# Altium schematic sheet CANdruino.SchDoc
size A3; SheetNumber: 1; SheetTotal: 1
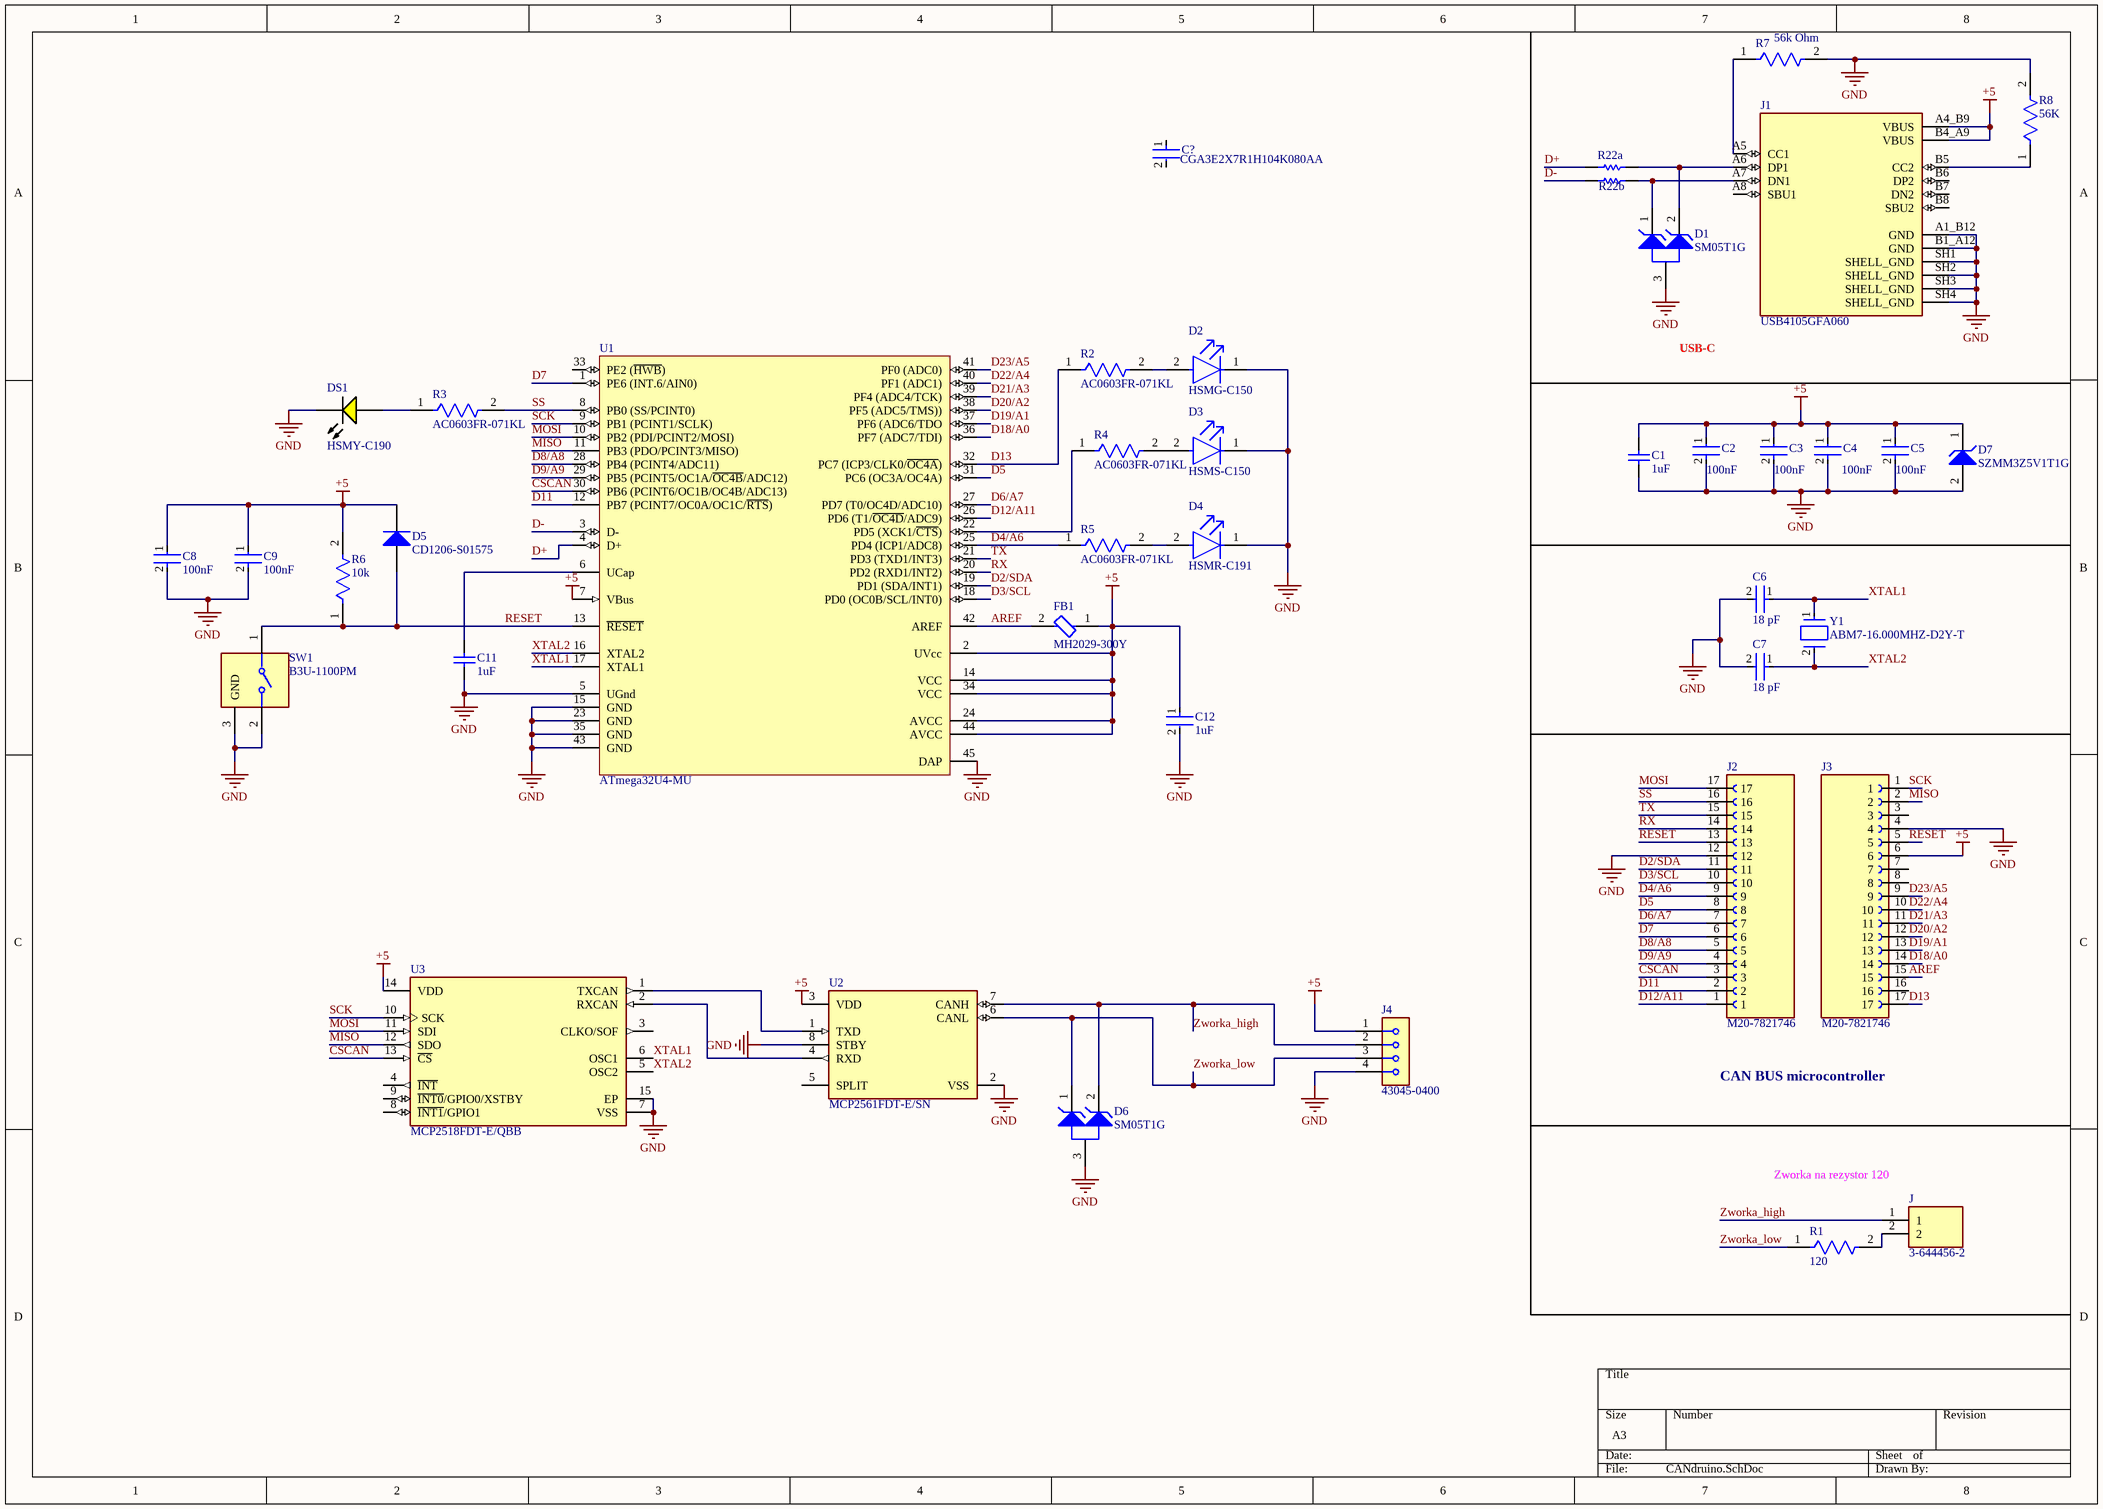
[diagram p0: CANdruino.SchDoc]

## Parts
C1  1uF  [CAPC2013X135X45LL10T25]
C2  100nF  [FP-GRM15-MFG]
C3  100nF  [FP-GRM15-MFG]
C4  100nF  [FP-GRM15-MFG]
C5  100nF  [FP-GRM15-MFG]
C6  18 pF  [FP-C0805C-DN-MFG]
C7  18 pF  [FP-C0805C-DN-MFG]
C8  100nF  [FP-GRM15-MFG]
C9  100nF  [FP-GRM15-MFG]
C11  1uF  [CAPC2013X135X45LL10T25]
C12  1uF  [FP-GRM15-0_1-MFG]
C?  CGA3E2X7R1H104K080AA  [FP-CGA3E-0_3-0_1-IPC_A]
D1  SM05T1G  [ONSC-SOT-23-3-318-08_V]
D2  HSMG-C150  [FP-HSMG-C150-MFG]
D3  HSMS-C150  [FP-HSMS-C150-MFG]
D4  HSMR-C191  [FP-HSMR-C191-MFG]
D5  CD1206-S01575  [BOUR-CD1206-S01575-2_L]
D6  SM05T1G  [ONSC-SOT-23-3-318-08_V]
D7  SZMM3Z5V1T1G  [ONSC-SOD-323-2-477-02_V]
DS1  HSMY-C190  [AVAG-HSMX-C190_V]
FB1  MH2029-300Y  [FP-MH2029-MFG]
J  3-644456-2  [TE_3-644456-2]
J1  USB4105GFA060  [GCT_USB4105GFA060]
J2  M20-7821746  [HARWIN_M20-7821746]
J3  M20-7821746  [HARWIN_M20-7821746]
J4  43045-0400  [MOLEX_43045-0400]
R1  120  [FP-CRCW0603-e3-MFG]
R2  AC0603FR-071KL  [FP-AC0603-IPC_B]
R3  AC0603FR-071KL  [FP-AC0603-IPC_B]
R4  AC0603FR-071KL  [FP-AC0603-IPC_B]
R5  AC0603FR-071KL  [FP-AC0603-IPC_B]
R6  10k  [FP-MCT0603-IPC_C]
R7  56k Ohm  [FP-RR0816-IPC_C]
R8  56K  [FP-RR0816-IPC_C]
R22a  22  [RESC1005X40X25LL05T05]  (value not drawn)
R22b  22  [RESC1005X40X25LL05T05]  (value not drawn)
SW1  B3U-1100PM  [FP-B3U-1100PM-MFG]
U1  ATmega32U4-MU  [44PW_M]
U2  MCP2561FDT-E/SN  [FP-C04-057-SN-MFG]
U3  MCP2518FDT-E/QBB  [FP-C04-21361-MFG]
Y1  ABM7-16.000MHZ-D2Y-T  [FP-ABM7-MFG]

## Nets
+5: C1.2 C2.1 C3.1 C4.1 C5.1 C8.1 C9.1 C12.1 D5.2(K) D7.1(K) FB1.1 J1.A4_B9(VBUS) J1.B4_A9(VBUS) J3.6 J4.1 R6.2 U1.2(UVcc) U1.7(VBus) U1.14(VCC) U1.24(AVCC) U1.34(VCC) U1.44(AVCC) U2.3(VDD) U3.14(VDD)
GND: C1.1 C2.2 C3.2 C4.2 C5.2 C6.2 C7.2 C8.2 C9.2 C11.1 C12.2 D1.3(A) D2.1(C) D3.1(C) D4.1(C) D6.3(A) D7.2(A) DS1.2(K) J1.A1_B12(GND) J1.B1_A12(GND) J1.SH1(SHELL_GND) J1.SH2(SHELL_GND) J1.SH3(SHELL_GND) J1.SH4(SHELL_GND) J2.12 J3.4 J4.4 R7.2 R8.2 SW1.2 SW1.3(GND) U1.5(UGnd) U1.15(GND) U1.23(GND) U1.35(GND) U1.43(GND) U1.45(DAP) U2.2(VSS) U2.8(STBY) U3.7(VSS) U3.15(EP)
AREF: FB1.2 J3.15 U1.42(AREF)
CSCAN: J2.3 U1.30(PB6_(PCINT6/OC1B/OC4B/ADC13)) U3.13(~{CS})
D2/SDA: J2.11 U1.19(PD1_(SDA/INT1))
D3/SCL: J2.10 U1.18(PD0_(OC0B/SCL/INT0))
D4/A6: J2.9 R5.1 U1.25(PD4_(ICP1/ADC8))
D5: J2.8 U1.31(PC6_(OC3A/OC4A))
D6/A7: J2.7 U1.27(PD7_(T0/OC4D/ADC10))
D7: J2.6 U1.1(PE6_(INT.6/AIN0))
D8/A8: J2.5 U1.28(PB4_(PCINT4/ADC11))
D9/A9: J2.4 U1.29(PB5_(PCINT5/OC1A/~{OC4B}/ADC12))
D11: J2.2 U1.12(PB7_(PCINT7/OC0A/OC1C/~{RTS}))
D12/A11: J2.1 U1.26(PD6_(T1/~{OC4D}/ADC9))
D13: J3.17 R2.1 U1.32(PC7_(ICP3/CLK0/~{OC4A}))
D18/A0: J3.14 U1.36(PF7_(ADC7/TDI))
D19/A1: J3.13 U1.37(PF6_(ADC6/TDO)
D20/A2: J3.12 U1.38(PF5_(ADC5/TMS)))
D21/A3: J3.11 U1.39(PF4_(ADC4/TCK))
D22/A4: J3.10 U1.40(PF1_(ADC1))
D23/A5: J3.9 U1.41(PF0_(ADC0))
D+: R22a.1 U1.4(D+)
D-: R22b.1 U1.3(D-)
MISO: J3.2 U1.11(PB3_(PDO/PCINT3/MISO)) U3.12(SDO)
MOSI: J2.17 U1.10(PB2_(PDI/PCINT2/MOSI)) U3.11(SDI)
RESET: D5.1(A) J2.13 J3.5 R6.1 SW1.1 U1.13(~{RESET})
RX: J2.14 U1.20(PD2_(RXD1/INT2))
SCK: J3.1 U1.9(PB1_(PCINT1/SCLK)) U3.10(SCK)
SS: J2.16 R3.2 U1.8(PB0_(SS/PCINT0))
TX: J2.15 U1.21(PD3_(TXD1/INT3))
XTAL1: C6.1 U1.17(XTAL1) U3.6(OSC1) Y1.1
XTAL2: C7.1 U1.16(XTAL2) U3.5(OSC2) Y1.2
Zworka_high: D6.2(K2) J.1 J4.2 U2.7(CANH)
Zworka_low: D6.1(K1) J4.3 R1.1 U2.6(CANL)
NetC11_2: C11.2 U1.6(UCap)
NetD1_1: D1.1(K1) J1.A7(DN1) R22b.2
NetD1_2: D1.2(K2) J1.A6(DP1) R22a.2
NetD2_2: D2.2(A) R2.2
NetD3_2: D3.2(A) R4.2
NetD4_2: D4.2(A) R5.2
NetDS1_1: DS1.1(A) R3.1
NetJ1_A5: J1.A5(CC1) R7.1
NetJ1_B5: J1.B5(CC2) R8.1
NetJ_2: J.2 R1.2
NetR4_1: R4.1 U1.22(PD5_(XCK1/~{CTS}))
NetU2_1: U2.1(TXD) U3.1(TXCAN)
NetU2_4: U2.4(RXD) U3.2(RXCAN)

Not connected (* = marked no-connect by the designer): C? 1 2; J1 A8(SBU1) B6(DP2) B7(DN2) B8(SBU2); J3 3 7 8 16; U1 33(PE2_(~{HWB})); U2 5(SPLIT); U3 3(CLKO/SOF) 4(~{INT}) 8(~{INT1}/GPIO1) 9(~{INT0}/GPIO0/XSTBY)

## Notes on the sheet
- USB-C
- CAN BUS microcontroller
- Zworka na rezystor 120

## Library data of the parts
C1 C11 = CMP-1036-04761-2: Manufacturer: Murata; Part Number: GRM21BR71H105KA12L
C2-C5 C8 C9 = CMP-2100-03641-2: CAP CER 0.1UF 16V X7R 0402; Manufacturer Part Number: GRM155R71C104KA88D; Manufacturer: Murata; Standoff Height: 0mm; Tolerance: 10%; Voltage Rating: 16Vdc; Material: Ceramic; Capacitance: 0.10μF; Value: 0.10μF; RoHS: TRUE; Temperature Characteristic: X7R; Octopart: https://octopart.com/grm155r71c104ka88d-murata-196880; Digikey Description: CAP CER 0.1UF 16V X7R 0402; Device Class L3: Ceramic Capacitors; Height: 0.55mm; ComponentLink2Description: Datasheet; Temperature Range Low: -55°C; Ipc Land Pattern Name: CAPC10050X219; ComponentLink2URL: https://search.murata.co.jp/Ceramy/image/img/A01X/G101/ENG/GRM155R71H471KA01-01A.pdf; Device Class L1: Passive Components; Lead Free: yes; Category: Cap; Package: GRM15; Temperature: -55°C to +125°C; Device Class L2: Capacitors; Temperature Range High: +125°C; Mouser Description: 0402 0.1 uF 16V ±10 % Tolerance X7R SMT Multilayer Ceramic Capacitor
C6 C7 = CMP-2007-00302-2: CAP CER 18PF 50V C0G/NP0 0805; Manufacturer: KEMET; Manufacturer Part Number: C0805C180J5GACTU; Temperature Characteristic: C0G; Tolerance: 0.05; Material: Ceramic; Temperature Coefficient: 30ppm/°C; Device Class L2: Capacitors; Capacitance: 18 pF; Temperature: -55°C to +125°C; Value: 18 pF; Package: C0805C-DN; Mouser Description: Cap Ceramic 18pF 50V C0G 5% SMD 0805 125C Paper T/R; Height: 0.88mm; ComponentLink2URL: https://content.kemet.com/datasheets/KEM_C1003_C0G_SMD.pdf; RoHS: TRUE; Octopart: https://octopart.com/c0805c180j5gactu-kemet-144810; ComponentLink2Description: Datasheet; Temperature Range High: +125°C; Digikey Description: CAP CER 18PF 50V C0G/NP0 0805; Device Class L1: Passive Components; Category: Cap; Automotive: No; Device Class L3: Ceramic Capacitors; Voltage Rating: 50 V; Temperature Range Low: -55°C; Ipc Land Pattern Name: CAPC200125X78; Lead Free: Yes
C12 = CMP-2008-04556-2: CAP CER 1UF 10V X5R 0402; Manufacturer Part Number: GRM155R61A105KE15D; Manufacturer: Murata; Material: Ceramic; Tolerance: 10%; Temperature Coefficient: 15%; Octopart: https://octopart.com/grm155r61a105ke15d-murata-197442; Lead Free: Yes; ComponentLink2Description: Datasheet; Temperature: -55°C to +85°C; Temperature Range High: +85°C; Height: 0.55mm; Capacitance: 1uF; Ipc Land Pattern Name: CAPC10050X50; ComponentLink2URL: https://search.murata.co.jp/Ceramy/image/img/A01X/G101/ENG/GRM155R61A105KE15-01A.pdf; Temperature Range Low: -55°C; Device Class L2: Capacitors; Voltage Rating: 10V; RoHS: TRUE; Device Class L1: Passive Components; Device Class L3: Ceramic Capacitors; Temperature Characteristic: X5R; Mouser Description: 0402 1 uF 10 V ±10% Tolerance X5R Surface Mount Multilayer Ceramic Capacitor; Automotive: No; Package: GRM15-0.1; Digikey Description: CAP CER 1UF 10V X5R 0402; Value: 1uF; Category: Cap
C? = CMP-2000-07546-2: Cap Ceramic 100nF 50V X7R 10% Pad SMD 0603 +125°C Automotive T/R; Weight: 7.1E-05oz; Composition: Ceramic; Max Operating Temperature: 125°C; Termination: SMD/SMT; Dielectric: X7R; Length: 1.6mm; Package Quantity: 1; REACH SVHC: No SVHC; Lead Free: Lead Free; Case Code (Metric): 1608; Min Operating Temperature: -55°C; Packaging: Tape and Reel; Tolerance: 10%; Voltage Rating: 50V; Case Code (Imperial): 0603; Capacitance: 100nF; Case/Package: 0603; Voltage Rating (DC): 50V; Depth: 0.8mm; Radiation Hardening: No; Ratings: AEC-Q200; Mount: Surface Mount; Voltage: 50V; Thickness: 0.035inch; Width: 0.8mm; Height: 0.8mm
D1 D6 = CMP-1061-00666-1: Transient Voltage Suppressor Diode Array, Dual Common Anode Diodes for ESD Protection, 3-Pin SOT-23, Pb-Free, Tape and Reel; Manufacturer: On Semiconductor; Direction: Unidirectional; IR Max (uA): 10; PPK Max (W): 300; ComponentLink2Description: Datasheet; PackageVersion: Rev. AP, 11/2009; ComponentLink2URL: http://www.onsemi.com/pub_link/Collateral/SM12T1-D.PDF; DatasheetVersion: Rev. 6; Packing: Tape and Reel; PartNumber: SM05T1G; ComponentLink3Description: Package Specification; ComponentLink1URL: http://www.onsemi.com/; ComponentLink3URL: http://www.onsemi.cn/pub_link/Collateral/318-08.PDF; PackageReference: SOT-23-3-318-08; ComponentLink1Description: Manufacturer URL; PackageDescription: 3-Pin Small Outline Transistor, Body 2.92 x 1.3 mm, Pitch 0.95 mm; Mounting Technology: Surface Mount; RoHS: Pb-Free
D2 = CMP-2000-05061-2: LED GREEN DIFFUSED 1206 SMD; Manufacturer: Broadcom; Led Orientation: Top View; Max Junction Temp: +95°C; Peak Emmision Wavelength: 570nm; Viewing Angle: 170°; Wavelength: 572nm; Reverse Voltage: 5V; Luminous Intensity: 15mcd; Forward Voltage: 2.2V; Power Dissipation: 65mW; Forward Current: 20mA; ComponentLink2Description: Datasheet; Lead Free: Yes; Temperature Range Low: -40°C; Package: HSMG-C150; Digikey Description: LED GREEN DIFFUSED 1206 SMD; Mouser Description: LED Uni-Color Green 570nm 2-Pin Chip LED T/R; Manufacturer Part Number: HSMG-C150; Temperature Range High: +85°C; Device Class L1: Optoelectronics; Colour: Green; Category: Diode; Device Class L3: unset; RoHS: TRUE; Height: 1.2mm; ComponentLink2URL: https://docs.broadcom.com/docs/AV02-0551EN; Device Class L2: LEDs; Automotive: No; Ipc Land Pattern Name: DIOCP320160X55; Octopart: https://octopart.com/hsmg-c150-broadcom-71131304; Temperature: -40°C to +85°C
D3 = CMP-21615-000001-1: LED RED DIFFUSED CHIP SMD; Luminous Intensity: 10mcd; Power Dissipation: 65mW; Viewing Angle: 170°; Number of Elements: 1; Forward Current: 20mA; Lens Color: White; Lens Style: Rectangular; Wavelength: 626nm; Forward Voltage: 2.1V; Reverse Voltage: 5V; Number of Pins: 2; Color: Red; Lead Free: Lead Free; Width: 1.6mm; Length: 3.2mm; REACH SVHC: No SVHC; Height: 1.1mm; Depth: 1.6mm; Power Rating: 65mW; Package Quantity: 1; Illumination Color: Red; Radiation Hardening: No; Case Code (Imperial): 1206; Max Operating Temperature: 85°C; Test Current: 20mA; Case/Package: 1206; Lens Transparency: Diffused; Number of LEDs: 1; Packaging: Tape and Reel; Mount: Surface Mount; Min Operating Temperature: -40°C; Case Code (Metric): 3216; Dominant Wavelength: 626nm
D4 = CMP-02129-71131536-1: HSMR-C191 High-Performance Chip LED Single Color LED, Blue, Untinted Diffused, 1mm; Power Dissipation: 78mW; Luminous Flux: 88lm; Number of Elements: 1; Test Current: 20mA; Forward Voltage: 3.4V; Wavelength: 473nm; Lens Color: Clear, White; Reverse Voltage: 5V; Viewing Angle: 140°; Luminous Intensity: 55mcd; Max Junction Temperature (Tj): 95°C; Peak Wavelength: 469nm; Case/Package: 0603; Mount: Surface Mount; Schedule B: 8541402000; Number of LEDs: 1; Min Operating Temperature: -40°C; Power Rating: 78mW; Case Code (Metric): 1608; Length: 1.6mm; Radiation Hardening: No; Dominant Wavelength: 473nm; Color: Blue; Width: 800µm; Lead Free: Lead Free; Illumination Color: Blue; Depth: 800µm; Height: 600µm; NexarPartId: 71131536; Case Code (Imperial): 0603; Number of Pins: 2; RoHS: Compliant; Max Operating Temperature: 85°C; Lens Transparency: Diffused; Packaging: Tape and Reel; Max Power Dissipation: 78mW; Lens Style: Diffused; Contact Plating: Gold; REACH SVHC: No SVHC; Forward Current: 20mA
D5 = CMP-0583-00001-2: 75 V Small Signal Switching Diode, 150 mA, 2.5 uA, 1026 Molded Package, RoHS, Tape and Reel; Manufacturer: Bourns; Reverse Voltage: 75 V; Average Forward Current: 150 mA; Reverse Current (Max.): 2.5 uA; Capacitance Between Terminals (Max.): 3 pF; Reverse Recovery Time (Max.): 4 nS; Forward Voltage (Max.): 1.00 V; Packing: Tape and Reel; Mounting Technology: Surface Mount; DatasheetVersion: Rev. 06/11; ComponentLink2URL: http://www.bourns.com/data/global/pdfs/CD1206_S01575.pdf; PackageReference: CD1206-S01575-2; RoHS: TRUE; ComponentLink1URL: http://www.bourns.com/; ComponentLink1Description: Manufacturer URL; ComponentLink3Description: Package Specification; ComponentLink3URL: http://www.bourns.com/data/global/pdfs/CD1206_S01575.pdf; ComponentLink2Description: Datasheet; PackageDescription: 2-Pin SMD, Body 3.2 x 1.5 mm; PartNumber: CD1206-S01575
D7 = CMP-1060-00693-1: Zener Voltage Regulator, 300 mW, 2-Pin SOD-323, Pb-Free, Tape and Reel; Manufacturer: On Semiconductor; VZ Typ (V): 5.1; P Max (W): 0.3; Mounting Technology: Surface Mount; PackageVersion: Rev. H, 03/2007; ComponentLink1Description: Manufacturer URL; ComponentLink2Description: Datasheet; ComponentLink3Description: Package Specification; DatasheetVersion: Rev. 9; ComponentLink3URL: http://www.onsemi.com/pub_link/Collateral/477-02.PDF.1; PartNumber: SZMM3Z5V1T1G; RoHS: Pb-Free; PackageReference: SOD-323-2-477-02; PackageDescription: 2-Pin SOD, Body 1.7 x 1.25 mm; Packing: Tape and Reel; ComponentLink2URL: http://www.onsemi.cn/pub_link/Collateral/MM3Z2V4T1-D.PDF; ComponentLink1URL: http://www.onsemi.com/
DS1 = CMP-1744-00003-1: LED Uni-Color Yellow, 65 mW, 20 mA, -40 to 85 degC, 2-Pin SMD, RoHS, Tape and Reel; Tolerance: 1%; Voltage Rating: 50 V; Power Rating: 100 mW; Case\Package: 0603; Resistance: 390 Ohm; Min Operating Temperature: -55 degC; Length: 1.6 mm; ComponentLink3Description: Package Specification; Mount: Surface Mount; PackageReference: HSMX-C190; ComponentLink2Description: Datasheet; DatasheetVersion: Mar-12; Case Code (Metric): 1608; Pins: 2; Package Quantity: 5000; ComponentLink2URL: http://docs.avagotech.com/docs/AV02-0551EN; ComponentLink1Description: Manufacturer URL; RoHSCompliant: true; Packaging: Tape and Reel; PackageDescription: 2-Pin Surface Mount Device, Body 1.6 x 0.8 mm, Height 0.9 mm; REACH SVHC: No SVHC; ComponentLink3URL: http://www.fairchildsemi.com/dwg/MA/MA03D.pdf; Voltage Rating (DC): 50 V; Width: 0.8 mm; ComponentLink1URL: http://www.avagotech.com/; Max Operating Temperature: 155 degC; Case Code (Imperial): 0603; Height: 0.45 mm
FB1 = CMP-07252-000001-1: FERRITE BEAD 30 OHM 0805 1LN; Manufacturer: Bourns; Series Resistance: 25mΩ; Resistance: 30Ω; Value: 30Ω; Impedance At Frequency: 30Ω @ 100MHz; Rms Current: 3A; Tolerance: 25%; RoHS: TRUE; Manufacturer Part Number: MH2029-300Y; Temperature Range High: +125°C; Device Class L3: Ferrite Beads and Chips; Core Material: Ferrite; ComponentLink2Description: Datasheet; Category: FBead; Octopart: https://octopart.com/mh2029-300y-bourns-756929; Digikey Description: FERRITE BEAD 30 OHM 0805 1LN; Device Class L2: EMI / RFI Components; Lead Free: Yes; Mouser Description: Ferrite Beads 30 ohms 25% HIGH CURRENT; Automotive: No; Ipc Land Pattern Name: CAPC200120X90; Temperature: -55°C to +125°C; Device Class L1: Passive Components; Height: 1.1mm; ComponentLink2URL: https://www.bourns.com/docs/Product-Datasheets/mh.pdf; Package: MH2029; Temperature Range Low: -55°C
J = CMP-002-00074-1: Connector Unshrouded Header HDR 2 Position 2.54mm Solder Straight Thru-Hole; Centerline_Pitch: 2.54 mm[.1 in]; MF: TE Connectivity; Number_of_Positions: 2; EU_RoHS_Compliance: Compliant; TE_purchase_URL: https://www.te.com/usa-en/product-3-644456-2.html?te_bu=Cor&te_type=disp&te_campaign=seda_glo_cor-seda-global-disp-prtnr-fy19-seda-model-bom-cta_sma-317_1&elqCampaignId=32493; Design Item ID: 3-644456-2; Pins: 2; Component Type: Standard; Source: SnapEDAsch.SchLib; MP: 3-644456-2; Value: *; Digi-Key_Purchase_URL: https://www.digikey.com/product-detail/en/te-connectivity-amp-connectors/3-644456-2/A31112-ND/698344?utm_source=snapeda&utm_medium=aggregator&utm_campaign=symbol; Digi-Key_Part_Number: A31112-ND; Product_Type: Connector; SnapEDA_Link: https://www.snapeda.com/parts/3-644456-2/TE%20Connectivity%20AMP%20Connectors/view-part/520887/?ref=snap; Case/Package: None
J1 = CMP-003-000000-1: MF: {'manufacturer': u'GCT'}; Package: None; Source: USB4105GFA060.SchLib; Pin Count: 16; Component Type: Standard; Value: *; Design Item ID: USB4105GFA060; Availability: Unavailable; Price: None; MP: USB4105GFA060
J2 J3 = CMP-002-00071-1: 2.54mm (0.1) Pitch SIL Vertical Throughboard Socket Assembly, tin, 17 contacts; MF: Harwin; Pins: 17; Source: M20-7821746.SchLib; Design Item ID: M20-7821746; Case/Package: None; Value: *; Check_prices: https://www.snapeda.com/parts/M20-7821746/Harwin/view-part/?ref=eda; SnapEDA_Link: https://www.snapeda.com/parts/M20-7821746/Harwin/view-part/?ref=snap; Component Type: Standard; MP: M20-7821746
J4 = CMP-002-00073-1: Conn Micro-Fit 2x2 Way Header 3mm Pitch r/Angle Ti; Component Type: Standard; Source: 43045-0400.SchLib; Value: *; Pins: 4; Design Item ID: 43045-0400; MP: 43045-0400; Availability: Unavailable; Price: None; Case/Package: None
R1 = CMP-1666-00020-3: RES Thick Film, 120Ω, 1%, 0.1W, 100ppm/°C, 0603; Power Rating: 100mW; Working Voltage: 75V; Resistance: 120R; RoHS Compliant: Yes; Lead Free: Lead Free; Termination: SMD/SMT; Radiation Hardening: No; Case Code (Imperial): 0603; Series: CRCW; Resistance Tolerance: 1%; Number of Terminations: 2; Tolerance: 1%; Max Operating Temperature: 155°C; Contact Plating: Tin; Package Quantity: 10; Max Power Dissipation: 100mW; Case Code (Metric): 1608; Weight: 7.1E-05oz; Packaging: Tape and Reel; Mount: Surface Mount; Military Standard: Not; Construction: Rectangular; Features: Automotive AEC-Q200; Depth: 0.85mm; Min Operating Temperature: -55°C; Case/Package: 0603; Height: 0.45mm; Voltage Rating (DC): 75V; Width: 0.033inch; Technology: THICK FILM; Length: 1.55mm; Voltage Rating: 75V; Temperature Coefficient: 100ppm/°C; Resistor Type: Thick Film
R2-R5 = CMP-2000-04828-3: RES 1kΩ 1.00% 0.1W 0603; Voltage Rating: 50V; Power Rating: 100mW; Tolerance: 1%; Temperature Coefficient: 100ppm/°C; Resistance: 1kR; Depth: 0.8mm; Case/Package: 0603; Size Code: 0603; Case Code (Metric): 1608; Height: 0.022inch; Series: AC; Width: 0.031inch; Construction: Rectangular; Length: 0.063inch; Case Code (Imperial): 0603; Package Quantity: 1; RoHS Compliant: Yes; Features: Moisture Resistant; Resistor Type: Thick Film; Max Power Dissipation: 100mW; Packaging: Tape and Reel; Termination: SMD/SMT; Ratings: AEC-Q200; Max Operating Temperature: 155°C; Min Operating Temperature: -55°C; Military Standard: Not; Lead Free: Lead Free; Number of Terminations: 2
R6 = CMP-02407-000418-1: RES SMD 100 OHM 1% 1/8W 0603; Voltage Rating: 75V; Power Rating: 100mW; Temperature Coefficient: 50ppm/°C; Max Power Dissipation: 125mW; Resistance: 10kR; Case/Package: 0603; Military Standard: Not; Min Operating Temperature: -55°C; Width: 0.8mm; Package Quantity: 1; Max Operating Temperature: 125°C; Tolerance: 1%; Depth: 0.85mm; Radiation Hardening: No; Mount: Surface Mount; Composition: Thin Film; Contact Plating: Tin; Lead Free: Lead Free; Case Code (Imperial): 0603; Number of Terminations: 2; Voltage Rating (DC): 75V; Length: 1.55mm; Packaging: Tape and Reel; Height: 0.022inch; Case Code (Metric): 1608
R7 R8 = CMP-2000-02705-2: 56kΩ ±0.5% 0.0625W 1/16W Chip Resistor 0603 (1608 Metric) Thin Film; Voltage Rating (DC): 75V; Power Rating: 62.5mW; Max Power Dissipation: 63mW; Resistance: 56kR; Temperature Coefficient: 25ppm/°C; Max Operating Temperature: 125°C; Min Operating Temperature: -55°C; Height: 0.4mm; Lead Free: Lead Free; Number of Pins: 2; Tolerance: 0.5%; Packaging: Tape and Reel; Resistance Tolerance: 0.5%; Series: RR; Number of Terminations: 2; Voltage Rating: 75V; Resistor Type: Thin Film; Technology: THIN FILM; Width: 0.031inch; RoHS Compliant: Yes; Termination: SMD/SMT; Length: 1.6mm; Package Quantity: 1; Case Code (Metric): 1608; Case/Package: 0603; Depth: 0.8mm; Case Code (Imperial): 0603
R22a R22b = CMP-2002-08382-1: Manufacturer: Vishay Dale; Part Number: CRCW040222R0FKED
SW1 = CMP-08834-000028-1: SWITCH TACTILE SPST-NO 0.05A 12V; Switch Travel: 0.15mm; Throw Configuration: SPST; Current Rating: 50mA; Illumination Type: Non-Illuminated; Actuator Length: 0.4mm; Operating Force: 1.5N; Connector Type: SMD/SMT; Contact Resistance: 100mR; Actuator Type: Standard; Electrical Life: 200000Cycles; Switch Function: Off-Mom; Ratings: Dust Proof; Max Operating Temperature: 70°C; Weight: 0.022g; Series: B3U; Min Operating Temperature: -25°C; Voltage Rating (DC): 12V; Orientation: Straight; Package Quantity: 1000; Packaging: Tape and Reel; RoHS Compliant: Yes; REACH SVHC: No SVHC; Max Voltage Rating (DC): 12V; Mount: Surface Mount; Case/Package: SMD/SMT; Mechanical Life: 200000Cycles; Termination: SMD/SMT
U1 = CMP-0095-00166-2: 8-bit AVR Microcontroller, 2.7-5.5V, 16MHz, 32KB Flash, 1KB EEPROM, 2.5KB SRAM, USB Controller, 44-pin QFN, Industrial Grade (-40°C to 85°C), Ext Osc; PackageVersion: revG, Sep-2009; PackageReference: 44PW; ComponentLink1URL: http://www.atmel.com/; PackageDescription: 44-Pin Quad Flat No-Lead Package, 7 x 7 mm Body, 0.5 mm Pitch (QFN); ComponentLink3Description: ATmega16U4 ATmega32U4 Summary; RevisionNote: DatasheetVersion, PackageVersion & PCB updated. URLs added.; ComponentLink2Description: ATmega16U4/32U4 Datasheet; ComponentLink1Description: Manufacturer URL; ComponentLink3URL: http://www.atmel.com/dyn/resources/prod_documents/7766S.pdf; DatasheetVersion: revF, Nov-2010; ComponentLink2URL: http://www.atmel.com/dyn/resources/prod_documents/doc7766.pdf; Code_JEDEC: MO-220-VKKD-1
U2 = CMP-06279-000064-1: IC TRANSCEIVER 1/1 8SOIC; Data Rate: 8Mbps; Operating Supply Current: 70mA; Max Supply Voltage: 5.5V; Number of Transceivers: 1; Receiver Hysteresis: 200mV; Min Supply Voltage: 4.5V; Case/Package: SOIC; Mount: Surface Mount; Weight: 0.019048oz; Min Operating Temperature: -40°C; Package Quantity: 3300; Series: -; Packaging: Tape and Reel; Max Operating Temperature: 125°C; RoHS Compliant: Yes; Number of Pins: 8
U3 = CMP-06298-000018-1: IC CAN CONTROLLER SPI 14VDFN; RoHS Compliant: Yes
Y1 = CMP-27762-000095-1: Crystal 16MHz ±20ppm 18pF SMD-2 6mm x 3.5mm; ESR (Equivalent Series Resistance): 50R; Frequency Stability: 30ppm; Width: 3.3mm; Frequency: 16MHz; Radiation Hardening: No; Height: 0.055inch; Tolerance: 20ppm; Length: 6mm; Case/Package: CSMD; Lead Free: Lead Free; Min Operating Temperature: -40°C; Termination: SMD/SMT; Operating Frequency: 16 MHz; Resistor Type: Ceramic; Packaging: Tape and Reel; Mount: Surface Mount; Load Capacitance: 18pF; Frequency Tolerance: 20ppm; Depth: 3.5mm; Series: ABM7; Package Quantity: 1000; Max Operating Temperature: 85°C; Number of Pins: 2